# Altium schematic sheet I2C TH Sensor Socket.SchDoc: T/H Sensor Socket
size 292 x 193 mm; SheetNumber: 11; SheetTotal: 40
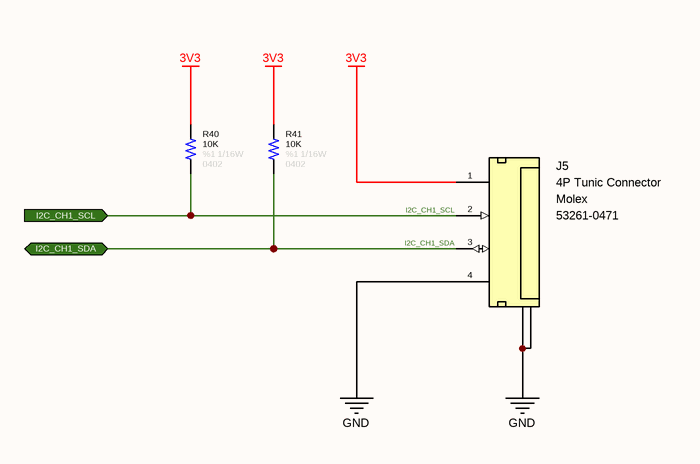
[diagram p0: I2C TH Sensor Socket.SchDoc]

## Parts
J5  Manufacturer Name: Molex  Manufacturer Part Number: 53261-0471  [Connector_Tunic 4P]  (hidden comment: 4P SMD Tunic Connector)
R40  value 10K  Tolerance: %1  Case: 0402  Power: 1/16W  [RESISTOR_0402]  (hidden comment: 10K - 0402 - %1 - 1/16W)
R41  value 10K  Tolerance: %1  Case: 0402  Power: 1/16W  [RESISTOR_0402]  (hidden comment: 10K - 0402 - %1 - 1/16W)

## Ports
I2C_CH1_SCL (in), I2C_CH1_SDA (bidir)

## Nets
3V3: J5.1(Pin-1) R40.2 R41.2
GND: J5.4(Pin-4) J5.5(GND) J5.6(GND)
I2C_CH1_SCL: J5.2(Pin-2) R40.1 ; port I2C_CH1_SCL
I2C_CH1_SDA: J5.3(Pin-3) R41.1 ; port I2C_CH1_SDA

## Notes on the sheet
- © 2021 All rights reserved.
  This document may not, in whole or in part, be copied, photocopied, reproduced, translated or converted to any electronic or machine readable from without prior written permission of Mehmet Günce Akkoyun.
  Engineer contact : akkoyun@me.com
- Property of
- Engineer :
- Date :
- Size :
- A4
- Time :
- Project :
- Page :
- /
- Customer :
- Product ID :
- Module ID :
- Version :
- File :
- Revision :
- (in symbol Connector - Mini Tunic 4P (1.25)) 4P Tunic Connector

## Library data of the parts
J5 = Connector - Mini Tunic 4P (1.25): Mini Tunic Connector with 4P; Pitch: 1.25mm; Position: 4; ROHS: Yes; ComponentLink1Description: DataSheet; ComponentLink1URL: https://www.mouser.com.tr/datasheet/2/276/0532610471_PCB_HEADERS-170942.pdf; ComponentLink2Description: Mouser; ComponentLink2URL: https://www.mouser.com.tr/ProductDetail/Molex/53261-0471?qs=%2Fha2pyFaduhLhIsk8tywtK7BwWtguBSP4XxyDBTOTfs%3D; Case: SMD; System: Connector
R40 R41 = Resistor - 10K [0402]: Thick Film Resistors - SMD 1/16 W 10 KOhm 1%; Manufacturer Name: Vishay; Manufacturer Part Number: CRCW040210K0FKED; ComponentLink1Description: DataSheet; ComponentLink1URL: https://www.mouser.com.tr/datasheet/2/427/dcrcwe3-1762152.pdf; ComponentLink2Description: Mouser; ComponentLink2URL: https://www.mouser.com.tr/ProductDetail/Vishay-Dale/CRCW040210K0FKED?qs=sGAEpiMZZMu61qfTUdNhG2DpbjADlD3GcalbOv9utCY%3D